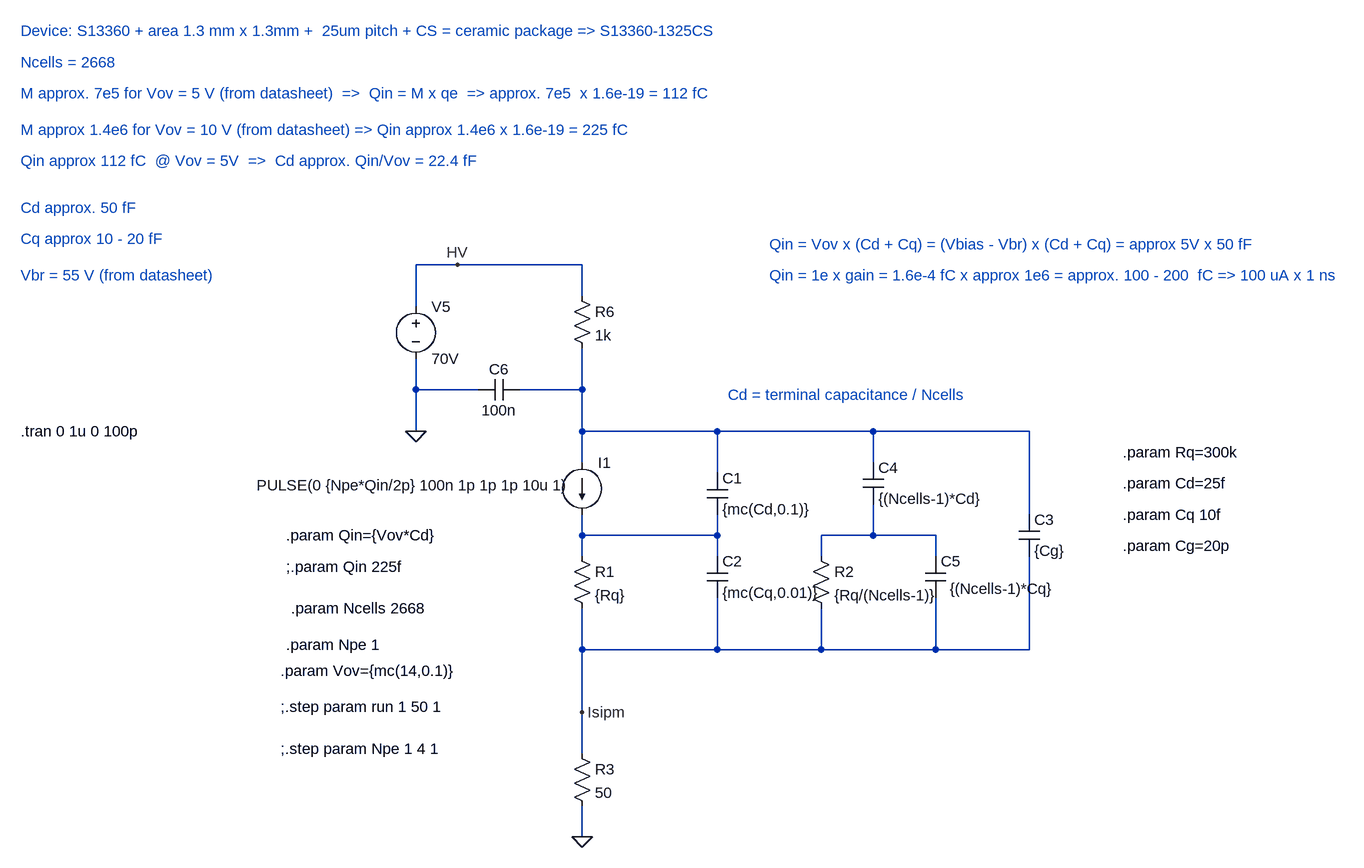
[diagram p0: schematic SipmModel.asc]
SipmModel.asc, the LTspice schematic file:
Version 4
SHEET 1 3380 1156
WIRE 1184 -448 1120 -448
WIRE 1376 -448 1184 -448
WIRE 1376 -400 1376 -448
WIRE 1120 -384 1120 -448
WIRE 1120 -256 1120 -304
WIRE 1216 -256 1120 -256
WIRE 1376 -256 1376 -320
WIRE 1376 -256 1280 -256
WIRE 1120 -192 1120 -256
WIRE 1376 -192 1376 -256
WIRE 1584 -192 1376 -192
WIRE 1824 -192 1584 -192
WIRE 2064 -192 1824 -192
WIRE 1376 -144 1376 -192
WIRE 1824 -144 1824 -192
WIRE 1584 -128 1584 -192
WIRE 2064 -64 2064 -192
WIRE 1376 -32 1376 -64
WIRE 1584 -32 1584 -64
WIRE 1584 -32 1376 -32
WIRE 1824 -32 1824 -80
WIRE 1824 -32 1744 -32
WIRE 1920 -32 1824 -32
WIRE 1376 0 1376 -32
WIRE 1584 0 1584 -32
WIRE 1744 0 1744 -32
WIRE 1920 0 1920 -32
WIRE 1376 144 1376 80
WIRE 1584 144 1584 64
WIRE 1584 144 1376 144
WIRE 1744 144 1744 80
WIRE 1744 144 1584 144
WIRE 1920 144 1920 64
WIRE 1920 144 1744 144
WIRE 2064 144 2064 0
WIRE 2064 144 1920 144
WIRE 1376 240 1376 144
WIRE 1376 304 1376 240
WIRE 1376 432 1376 384
FLAG 1376 240 Isipm
FLAG 1376 432 0
FLAG 1120 -192 0
FLAG 1184 -448 HV
SYMBOL current 1376 -144 R0
WINDOW 3 -501 35 Left 2
WINDOW 123 0 0 Left 2
WINDOW 39 0 0 Left 2
SYMATTR Value PULSE(0 {Npe*Qin/2p} 100n 1p 1p 1p 10u 1)
SYMATTR InstName I1
SYMBOL res 1360 -16 R0
SYMATTR InstName R1
SYMATTR Value {Rq}
SYMBOL cap 1568 -128 R0
SYMATTR InstName C1
SYMATTR Value {mc(Cd,0.1)}
SYMBOL cap 1568 0 R0
SYMATTR InstName C2
SYMATTR Value {mc(Cq,0.01)}
SYMBOL cap 2048 -64 R0
SYMATTR InstName C3
SYMATTR Value {Cg}
SYMBOL cap 1808 -144 R0
SYMATTR InstName C4
SYMATTR Value {(Ncells-1)*Cd}
SYMBOL res 1728 -16 R0
SYMATTR InstName R2
SYMATTR Value {Rq/(Ncells-1)}
SYMBOL cap 1904 0 R0
WINDOW 3 38 50 Left 2
SYMATTR Value {(Ncells-1)*Cq}
SYMATTR InstName C5
SYMBOL res 1360 288 R0
SYMATTR InstName R3
SYMATTR Value 50
SYMBOL res 1360 -416 R0
SYMATTR InstName R6
SYMATTR Value 1k
SYMBOL cap 1280 -272 R90
WINDOW 0 0 32 VBottom 2
WINDOW 3 32 32 VTop 2
SYMATTR InstName C6
SYMATTR Value 100n
SYMBOL voltage 1120 -400 R0
WINDOW 123 0 0 Left 2
WINDOW 39 0 0 Left 2
SYMATTR InstName V5
SYMATTR Value 70V
TEXT 512 -192 Left 2 !.tran 0 1u 0 100p
TEXT 1664 -432 Left 2 ;Qin = 1e x gain = 1.6e-4 fC x approx 1e6 = approx. 100 - 200  fC => 100 uA x 1 ns
TEXT 2208 -160 Left 2 !.param Rq=300k
TEXT 2208 -112 Left 2 !.param Cd=25f
TEXT 2208 -16 Left 2 !.param Cg=20p
TEXT 920 16 Left 2 !;.param Qin 225f
TEXT 2208 -64 Left 2 !.param Cq 10f
TEXT 512 -536 Left 2 ;Cd approx. 50 fF
TEXT 512 -488 Left 2 ;Cq approx 10 - 20 fF
TEXT 928 80 Left 2 !.param Ncells 2668
TEXT 1664 -480 Left 2 ;Qin = Vov x (Cd + Cq) = (Vbias - Vbr) x (Cd + Cq) = approx 5V x 50 fF
TEXT 920 136 Left 2 !.param Npe 1
TEXT 912 176 Left 2 !.param Vov={mc(14,0.1)}
TEXT 512 -712 Left 2 ;M approx. 7e5 for Vov = 5 V (from datasheet)  =>  Qin = M x qe  => approx. 7e5  x 1.6e-19 = 112 fC
TEXT 512 -608 Left 2 ;Qin approx 112 fC  @ Vov = 5V  =>  Cd approx. Qin/Vov = 22.4 fF
TEXT 512 -432 Left 2 ;Vbr = 55 V (from datasheet)
TEXT 512 -656 Left 2 ;M approx 1.4e6 for Vov = 10 V (from datasheet) => Qin approx 1.4e6 x 1.6e-19 = 225 fC
TEXT 912 232 Left 2 !;.step param run 1 50 1
TEXT 512 -808 Left 2 ;Device: S13360 + area 1.3 mm x 1.3mm +  25um pitch + CS = ceramic package => S13360-1325CS
TEXT 512 -760 Left 2 ;Ncells = 2668
TEXT 912 296 Left 2 !;.step param Npe 1 4 1
TEXT 920 -32 Left 2 !.param Qin={Vov*Cd}
TEXT 1600 -248 Left 2 ;Cd = terminal capacitance / Ncells

The netlist it stands for:
* SipmModel.asc
I1 N001 N002 PULSE(0 {Npe*Qin/2p} 100n 1p 1p 1p 10u 1)
R1 N002 Isipm {Rq}
C1 N001 N002 {mc(Cd,0.1)}
C2 N002 Isipm {mc(Cq,0.01)}
C3 N001 Isipm {Cg}
C4 N001 N003 {(Ncells-1)*Cd}
R2 N003 Isipm {Rq/(Ncells-1)}
C5 N003 Isipm {(Ncells-1)*Cq}
R3 Isipm 0 50
R6 HV N001 1k
C6 N001 0 100n
V5 HV 0 70V
.tran 0 1u 0 100p
* Qin = 1e x gain = 1.6e-4 fC x approx 1e6 = approx. 100 - 200  fC => 100 uA x 1 ns
.param Rq=300k
.param Cd=25f
.param Cg=20p
;.param Qin 225f
.param Cq 10f
* Cd approx. 50 fF
* Cq approx 10 - 20 fF
.param Ncells 2668
* Qin = Vov x (Cd + Cq) = (Vbias - Vbr) x (Cd + Cq) = approx 5V x 50 fF
.param Npe 1
.param Vov={mc(14,0.1)}
* M approx. 7e5 for Vov = 5 V (from datasheet)  =>  Qin = M x qe  => approx. 7e5  x 1.6e-19 = 112 fC
* Qin approx 112 fC  @ Vov = 5V  =>  Cd approx. Qin/Vov = 22.4 fF
* Vbr = 55 V (from datasheet)
* M approx 1.4e6 for Vov = 10 V (from datasheet) => Qin approx 1.4e6 x 1.6e-19 = 225 fC
;.step param run 1 50 1
* Device: S13360 + area 1.3 mm x 1.3mm +  25um pitch + CS = ceramic package => S13360-1325CS
* Ncells = 2668
;.step param Npe 1 4 1
.param Qin={Vov*Cd}
* Cd = terminal capacitance / Ncells
.backanno
.end